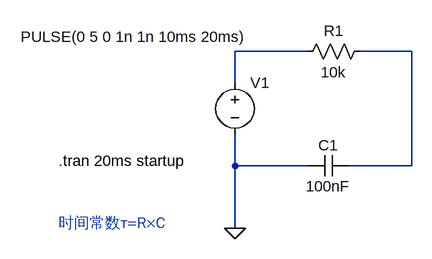
[diagram p0: schematic RC充放电电路.asc]
RC充放电电路.asc, the LTspice schematic file:
Version 4.1
SHEET 1 884 680
WIRE 192 16 80 16
WIRE 352 16 272 16
WIRE 80 64 80 16
WIRE 80 192 80 144
WIRE 192 192 80 192
WIRE 352 192 352 16
WIRE 352 192 256 192
WIRE 80 288 80 192
FLAG 80 288 0
SYMBOL voltage 80 48 R0
WINDOW 3 -330 -55 Left 2
WINDOW 123 0 0 Left 0
WINDOW 39 0 0 Left 0
SYMATTR Value PULSE(0 5 0 1n 1n 10ms 20ms)
SYMATTR InstName V1
SYMBOL res 288 0 R90
WINDOW 0 0 56 VBottom 2
WINDOW 3 32 56 VTop 2
SYMATTR InstName R1
SYMATTR Value 10k
SYMBOL cap 256 176 R90
WINDOW 0 0 32 VBottom 2
WINDOW 3 32 32 VTop 2
SYMATTR InstName C1
SYMATTR Value 100nF
TEXT -192 184 Left 2 !.tran 20ms startup
TEXT -192 280 Left 2 ;时间常数τ=R×C

The netlist it stands for:
* RC充放电电路.asc
V1 N001 0 PULSE(0 5 0 1n 1n 10ms 20ms)
R1 N002 N001 10k
C1 N002 0 100nF
.tran 20ms startup
* 时间常数τ=R×C
.backanno
.end